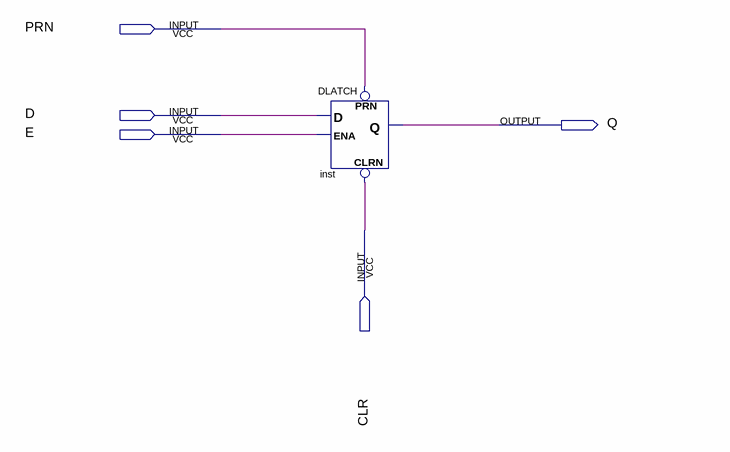
[diagram p0: schematic sheet]
// Quartus schematic DLatchDiagram.bdf as structural Verilog: 1 symbols, 5 pins
module DLatchDiagram (
  input  PRN,
  input  D,
  input  E,
  input  CLR,
  output Q
);

  DLATCH inst (.CLRN(CLR), .D(D), .ENA(E), .PRN(PRN), .Q(Q));
endmodule
